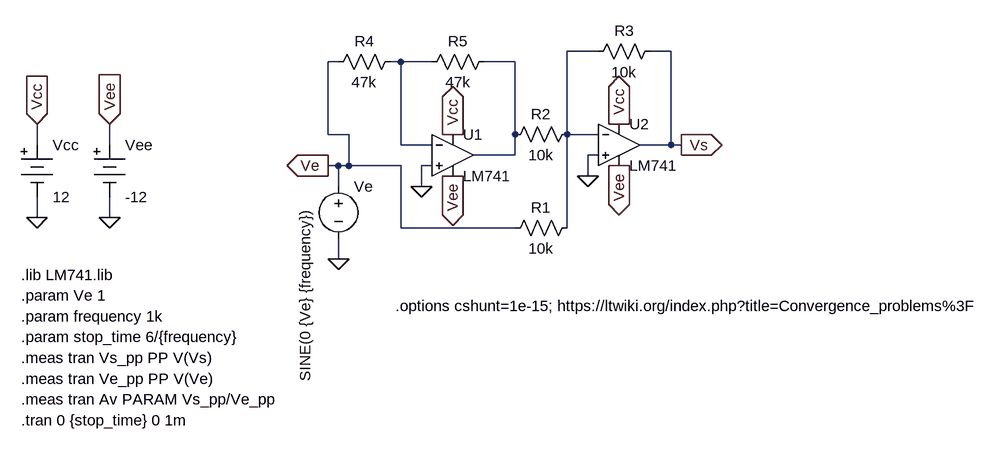
[diagram p0: schematic Exp1c.asc]
Exp1c.asc, the LTspice schematic file:
Version 4.1
SHEET 1 2388 680
WIRE 416 0 368 0
WIRE 528 0 496 0
WIRE 16 16 0 16
WIRE 112 16 96 16
WIRE 160 16 112 16
WIRE 288 16 240 16
WIRE 0 128 0 16
WIRE 32 128 0 128
WIRE 288 128 288 16
WIRE 368 128 368 0
WIRE 416 128 368 128
WIRE -448 144 -448 112
WIRE -336 144 -336 112
WIRE 112 144 112 16
WIRE 160 144 112 144
WIRE 528 144 528 0
WIRE 528 144 480 144
WIRE 544 144 528 144
WIRE 288 160 288 128
WIRE 288 160 224 160
WIRE 416 160 400 160
WIRE 16 176 0 176
WIRE 32 176 32 128
WIRE 32 176 16 176
WIRE 112 176 32 176
WIRE 160 176 144 176
WIRE 400 192 400 160
WIRE 16 208 16 176
WIRE 144 208 144 176
WIRE -448 256 -448 224
WIRE -336 256 -336 224
WIRE 112 272 112 176
WIRE 288 272 112 272
WIRE 368 272 368 128
WIRE 16 320 16 288
FLAG -336 112 Vee
IOPIN -336 112 In
FLAG -448 112 Vcc
IOPIN -448 112 In
FLAG 192 128 Vcc
IOPIN 192 128 Out
FLAG 192 192 Vee
IOPIN 192 192 Out
FLAG 16 320 0
FLAG -448 256 0
FLAG -336 256 0
FLAG 544 144 Vs
IOPIN 544 144 Out
FLAG 0 176 Ve
IOPIN 0 176 Out
FLAG 448 112 Vcc
IOPIN 448 112 Out
FLAG 448 176 Vee
IOPIN 448 176 Out
FLAG 400 192 0
FLAG 144 208 0
SYMBOL OpAmps\\LM741 192 96 R0
SYMATTR InstName U1
SYMBOL voltage 16 192 R0
WINDOW 123 0 0 Left 0
WINDOW 39 0 0 Left 0
WINDOW 3 -51 316 VLeft 2
SYMATTR Value SINE(0 {Ve} {frequency})
SYMATTR InstName Ve
SYMBOL Misc\\battery -448 128 R0
SYMATTR InstName Vcc
SYMATTR Value 12
SYMBOL Misc\\battery -336 128 R0
SYMATTR InstName Vee
SYMATTR Value -12
SYMBOL OpAmps\\LM741 448 80 R0
SYMATTR InstName U2
SYMBOL res 384 112 R90
WINDOW 0 0 56 VBottom 2
WINDOW 3 32 56 VTop 2
SYMATTR InstName R2
SYMATTR Value 10k
SYMBOL res 384 256 R90
WINDOW 0 0 56 VBottom 2
WINDOW 3 32 56 VTop 2
SYMATTR InstName R1
SYMATTR Value 10k
SYMBOL res 512 -16 R90
WINDOW 0 0 56 VBottom 2
WINDOW 3 32 56 VTop 2
SYMATTR InstName R3
SYMATTR Value 10k
SYMBOL res 112 0 R90
WINDOW 0 0 56 VBottom 2
WINDOW 3 32 56 VTop 2
SYMATTR InstName R4
SYMATTR Value 47k
SYMBOL res 256 0 R90
WINDOW 0 0 56 VBottom 2
WINDOW 3 32 56 VTop 2
SYMATTR InstName R5
SYMATTR Value 47k
TEXT -472 376 Left 2 !.param Ve 1
TEXT -472 472 Left 2 !.meas tran Vs_pp PP V(Vs)
TEXT -472 408 Left 2 !.param frequency 1k
TEXT -472 568 Left 2 !.tran 0 {stop_time} 0 1m
TEXT -472 440 Left 2 !.param stop_time 6/{frequency}
TEXT -472 504 Left 2 !.meas tran Ve_pp PP V(Ve)
TEXT -472 344 Left 2 !.lib LM741.lib
TEXT -472 536 Left 2 !.meas tran Av PARAM Vs_pp/Ve_pp
TEXT 104 392 Left 2 !.options cshunt=1e-15; https://ltwiki.org/index.php?title=Convergence_problems%3F

The netlist it stands for:
* Exp1c.asc
X§U1 0 N002 Vcc Vee N003 LM741  ; pins In+ In- V+ V- OUT
Ve Ve 0 SINE(0 {Ve} {frequency})
Vcc Vcc 0 12
Vee Vee 0 -12
X§U2 0 N001 Vcc Vee Vs LM741  ; pins In+ In- V+ V- OUT
R2 N001 N003 10k
R1 N001 Ve 10k
R3 Vs N001 10k
R4 N002 Ve 47k
R5 N003 N002 47k
.param Ve 1
.meas tran Vs_pp PP V(Vs)
.param frequency 1k
.tran 0 {stop_time} 0 1m
.param stop_time 6/{frequency}
.meas tran Ve_pp PP V(Ve)
.lib LM741.lib
.meas tran Av PARAM Vs_pp/Ve_pp
.options cshunt=1e-15; https://ltwiki.org/index.php?title=Convergence_problems%3F
.lib LM741.lib
.backanno
.end